# Altium schematic sheet LTC6362_Schematic.SchDoc
size A; SheetNumber: 13; SheetTotal: 15
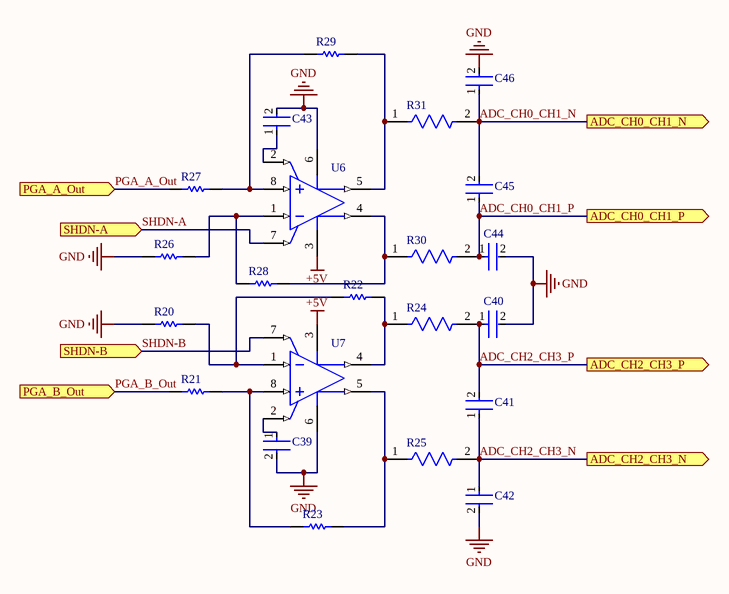
[diagram p0: LTC6362_Schematic.SchDoc]

## Parts
C39  GQM1875C2ER10BB12D  [FP-GQM187-0_15-MFG]  (value not drawn)
C40  CC0603KRX7R9BB392  [FP-CC0603-DA-MFG]  (value not drawn)
C41  CC0603KRX7R9BB392  [FP-CC0603-DA-MFG]  (value not drawn)
C42  CC0603KRX7R9BB392  [FP-CC0603-DA-MFG]  (value not drawn)
C43  GQM1875C2ER10BB12D  [FP-GQM187-0_15-MFG]  (value not drawn)
C44  CC0603KRX7R9BB392  [FP-CC0603-DA-MFG]  (value not drawn)
C45  CC0603KRX7R9BB392  [FP-CC0603-DA-MFG]  (value not drawn)
C46  CC0603KRX7R9BB392  [FP-CC0603-DA-MFG]  (value not drawn)
R20  ERJ-6ENF1241V  [RESC2013X70X40LL20T20]  (value not drawn)
R21  ERJ-6ENF1241V  [RESC2013X70X40LL20T20]  (value not drawn)
R22  RC0805FR-071KL  [RESC2013X60X35ML10T20]  (value not drawn)
R23  RC0805FR-071KL  [RESC2013X60X35ML10T20]  (value not drawn)
R24  CRCW060335R7FKEA  [FP-CRCW0603-e3-IPC_B]  (value not drawn)
R25  CRCW060335R7FKEA  [FP-CRCW0603-e3-IPC_B]  (value not drawn)
R26  ERJ-6ENF1241V  [RESC2013X70X40LL20T20]  (value not drawn)
R27  ERJ-6ENF1241V  [RESC2013X70X40LL20T20]  (value not drawn)
R28  RC0805FR-071KL  [RESC2013X60X35ML10T20]  (value not drawn)
R29  RC0805FR-071KL  [RESC2013X60X35ML10T20]  (value not drawn)
R30  CRCW060335R7FKEA  [FP-CRCW0603-e3-IPC_B]  (value not drawn)
R31  CRCW060335R7FKEA  [FP-CRCW0603-e3-IPC_B]  (value not drawn)
U6  LTC6362HMS8#PBF  [LT-MS8-8_L]  (value not drawn)
U7  LTC6362HMS8#PBF  [LT-MS8-8_L]  (value not drawn)

## Ports
ADC_CH0_CH1_N (out), ADC_CH0_CH1_P (out), ADC_CH2_CH3_N (out), ADC_CH2_CH3_P (out), PGA_A_Out (in), PGA_B_Out (in), SHDN-A (in), SHDN-B (in)

## Nets
+5V: U6.3(V+) U7.3(V+)
GND: C39.2 C40.2 C42.2 C43.2 C44.2 C46.2 R20.1 R26.1 U6.6(V-) U7.6(V-)
ADC_CH0_CH1_N: C45.2 C46.1 R31.2 ; port ADC_CH0_CH1_N
ADC_CH0_CH1_P: C44.1 C45.1 R30.2 ; port ADC_CH0_CH1_P
ADC_CH2_CH3_N: C41.1 C42.1 R25.2 ; port ADC_CH2_CH3_N
ADC_CH2_CH3_P: C40.1 C41.2 R24.2 ; port ADC_CH2_CH3_P
PGA_A_Out: R27.1 ; port PGA_A_Out
PGA_B_Out: R21.1 ; port PGA_B_Out
SHDN-A: U6.7(~{SHDN}) ; port SHDN-A
SHDN-B: U7.7(~{SHDN}) ; port SHDN-B
NetC39_1: C39.1 U7.2(VOCM)
NetC43_1: C43.1 U6.2(VOCM)
NetR20_2: R20.2 R22.1 U7.1(-IN)
NetR21_2: R21.2 R23.1 U7.8(+IN)
NetR22_2: R22.2 R24.1 U7.4(+OUT)
NetR23_2: R23.2 R25.1 U7.5(-OUT)
NetR26_2: R26.2 R28.1 U6.1(-IN)
NetR27_2: R27.2 R29.1 U6.8(+IN)
NetR28_2: R28.2 R30.1 U6.4(+OUT)
NetR29_2: R29.2 R31.1 U6.5(-OUT)

## Library data of the parts
C39 C43 = CMP-06035-052255-1: Ceramic Capacitor 0.1pF ±0.1pF 250VDC C0G 0603 Paper T/R; Voltage Rating: 250V; Width: 0.031inch; Length: 1.6mm; Max Operating Temperature: 125°C; Min Operating Temperature: -55°C; Height: 0.7mm; Dielectric: C0G; Termination: SMD/SMT; Depth: 0.8mm; Case/Package: 0603; Package Quantity: 4000; Radiation Hardening: No; Case Code (Metric): 1608; Thickness: 0.031inch; Capacitance: 0.1pF; Case Code (Imperial): 0603; Voltage Rating (DC): 250V; Packaging: Tape and Reel; Mount: Surface Mount
C40-C42 C44-C46 = CMP-03422-000635-2: CAP CER 3900PF 50V X7R 0603; Tolerance: 10%; Dielectric Material: Ceramic; Capacitance: 3.9nF; Insulation Resistance: 100GR; Height: 0.8mm; Voltage Rating: 50V; Termination: SMD/SMT; REACH SVHC: No SVHC; Resistor Type: Ceramic; Radiation Hardening: No; Case Code (Imperial): 0603; Voltage: 50V; Series: CC; Mount: Surface Mount; Length: 1.6mm; RoHS Compliant: Yes; Lead Free: Lead Free; Width: 0.8mm; Package Quantity: 4000; Packaging: Tape and Reel; Dielectric: X7R; Voltage Rating (DC): 50V; Min Operating Temperature: -55°C; Depth: 0.8mm; Halogen Free: Halogen Free; Case/Package: 0603; Thickness: 0.035inch; Number of Pins: 2; Max Operating Temperature: 125°C; Case Code (Metric): 1608; Construction: Flat
R20 R21 R26 R27 = CMP-2001-04406-1: Manufacturer: Panasonic; Part Number: ERJ-6ENF1241V
R22 R23 R28 R29 = CMP-2100-03671-1: Chip Resistor, 1 KOhm, +/- 1%, 125 mW, -55 to 155 degC, 0805 (2012 Metric), RoHS, Tape and Reel; Manufacturer: Yageo; Temperature Coefficient: 100ppm/degreesC; Voltage Rating (DC): 150V; Max Power Dissipation: 125mW; Resistance: 1KOhm; Number of Pins: 2; Number of Terminations: 2; Datasheet URL: http://www.yageo.com/NewPortal/yageodocoutput?fileName=/pdf/R-Chip/PYu-RC_Group_51_RoHS_L_5.pdf; Length: 0.079inch; Package Description: 2-Pin Surface Mounted Device, Body 2 x 1.25 mm; Depth: 1.25mm; Height: 0.024inch; Military Standard: Not; Case/Package: 0805; Package Reference: 0805; RoHSCompliant: true; Lead Free: LeadFree; Packaging: TapeandReel; Package Quantity: 1; Datasheet Version: Rev. 5, 10/2016; Tolerance: 1%; Min Operating Temperature: -55degC; Voltage Rating: 150V; Composition: ThickFilm; Case Code (Imperial): 0805; Power Rating: 125mW; Width: 0.049inch; Case Code (Metric): 2012; Manufacturer URL: http://www.yageo.com/; Max Operating Temperature: 155degC; REACH SVHC: Unknown; Termination: SMD/SMT
R24 R25 R30 R31 = CMP-02407-005475-1: RES Thick Film, 35.7Ω, 1%, 0.1W, 100ppm/°C, 0603; Resistance: 35.7R; Max Power Dissipation: 100mW; Voltage Rating (DC): 75V; Weight: 7.1E-05oz; Contact Plating: Tin; Width: 0.85mm; Features: Automotive AEC-Q200; Package Quantity: 10; Tolerance: 1%; Height: 0.02inch; Mount: Surface Mount; Packaging: Tape and Reel; Termination: SMD/SMT; Power Rating: 100mW; Case Code (Metric): 1608; Case/Package: 0603; Voltage Rating: 75V; Depth: 0.85mm; Number of Terminations: 2; Composition: Thick Film; Lead Free: Lead Free; Max Operating Temperature: 155°C; Case Code (Imperial): 0603; Min Operating Temperature: -55°C; Radiation Hardening: No; Length: 1.55mm; Number of Pins: 2; Military Standard: Not; Temperature Coefficient: 100ppm/°C
U6 U7 = CMP-0359-00920-2: Single Channel, Precision, Low Power Differential Operational Amplifier / SAR ADC Driver, RRIO, 180 MHz Typical GBW, 45 V/us Typical SR, 2.8 to 5.25 V, 8-Pin SOP (MS8-8), High Temperature / Automotive, Pb-Free; Manufacturer: Linear Technology; Vs Max (V): 5.25; Is (mA) Typical: 0.9; SR (V/us) Typical: 45; Channels (#): 1; GBW (MHz) Typical: 180; Vos (mV) Typical: 0.05; Vs Min (V): 2.8; PartNumber: LTC6362HMS8#PBF; PackageDescription: 8-Lead Plastic Small Outline, Body 3.9 x 4.9 mm, Pitch 1.27 mm; ComponentLink2Description: Datasheet; ComponentLink3URL: http://cds.linear.com/docs/en/packaging/05081610_G_SO8.pdf; ComponentLink1Description: Manufacturer URL; PackageReference: LT-MS8-8; ComponentLink2URL: http://cds.linear.com/docs/en/datasheet/6362fa.pdf; PackageVersion: Rev G; Mounting Technology: Surface Mount; Linear Technology Part Number: LTC6362; DatasheetVersion: Rev. A; RevisionNote: URLs updated; RoHS: Pb-Free; ComponentLink1URL: http://www.linear.com/; Type: DIFF; ComponentLink3Description: Package Specification